# Altium project HGD_Sensor(v0.1)-20200807.PrjPcb
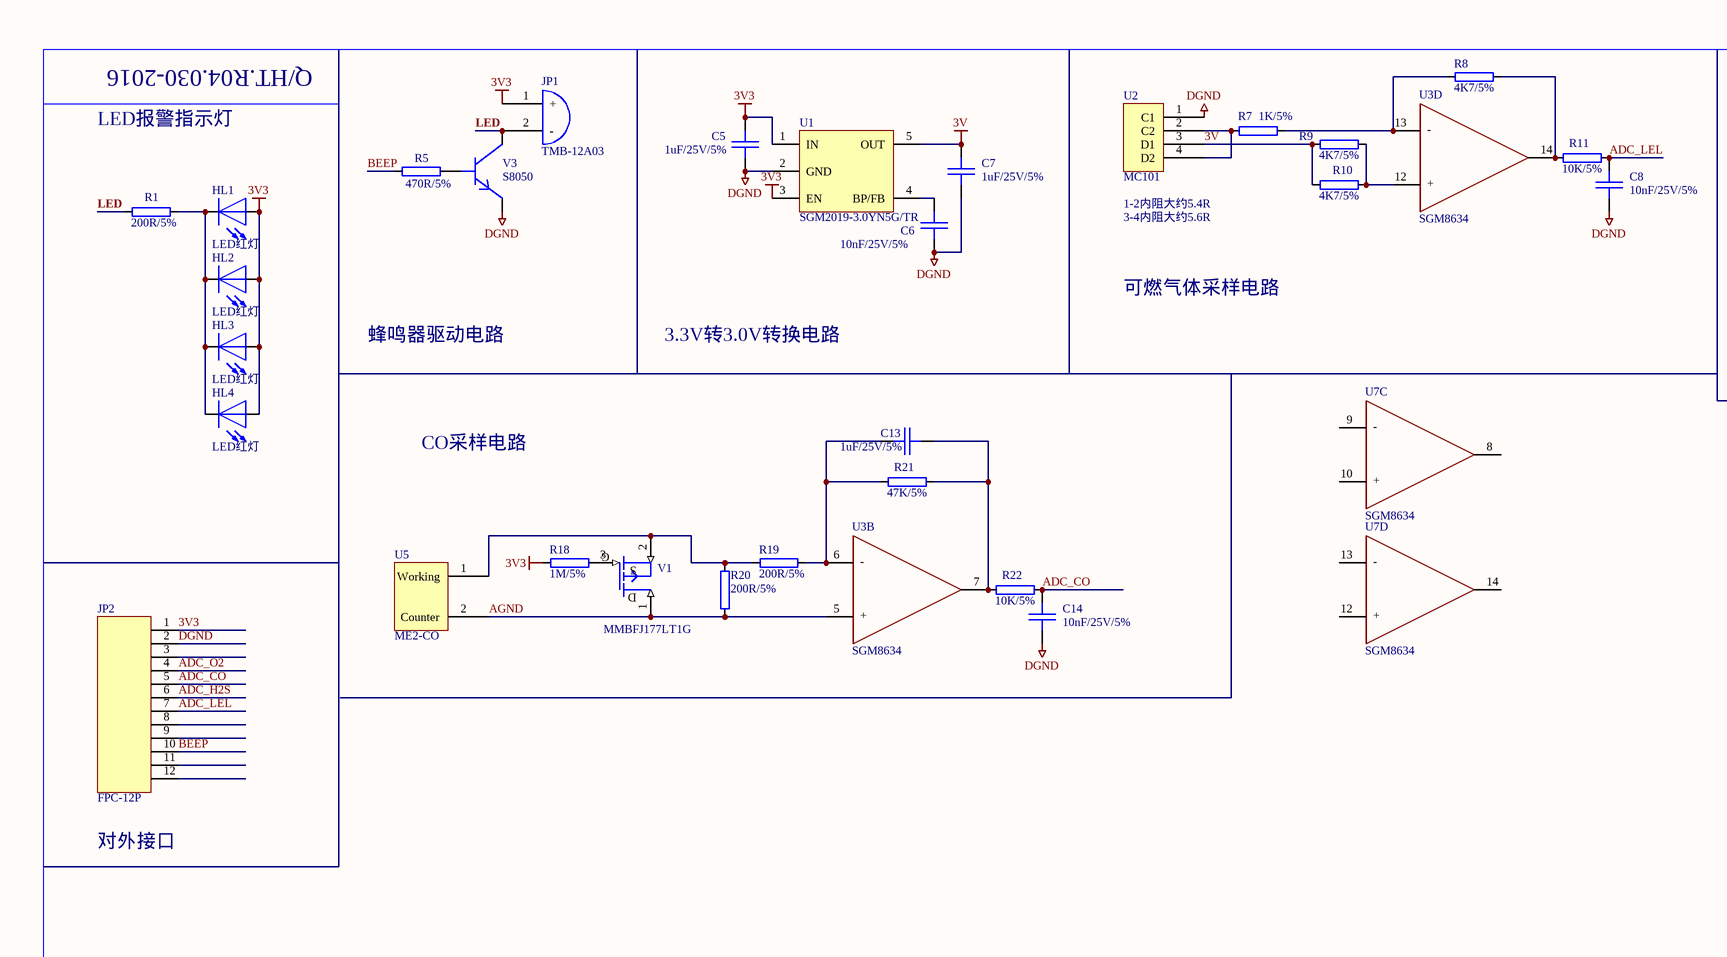
[diagram p0: HGD_Sensor(v0.1)-20200807.SchDoc, top left]
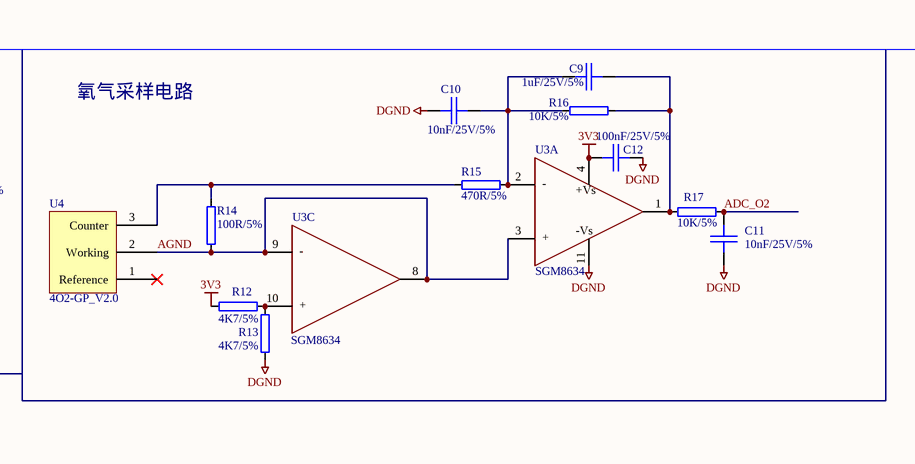
[diagram p1: HGD_Sensor(v0.1)-20200807.SchDoc, top right]
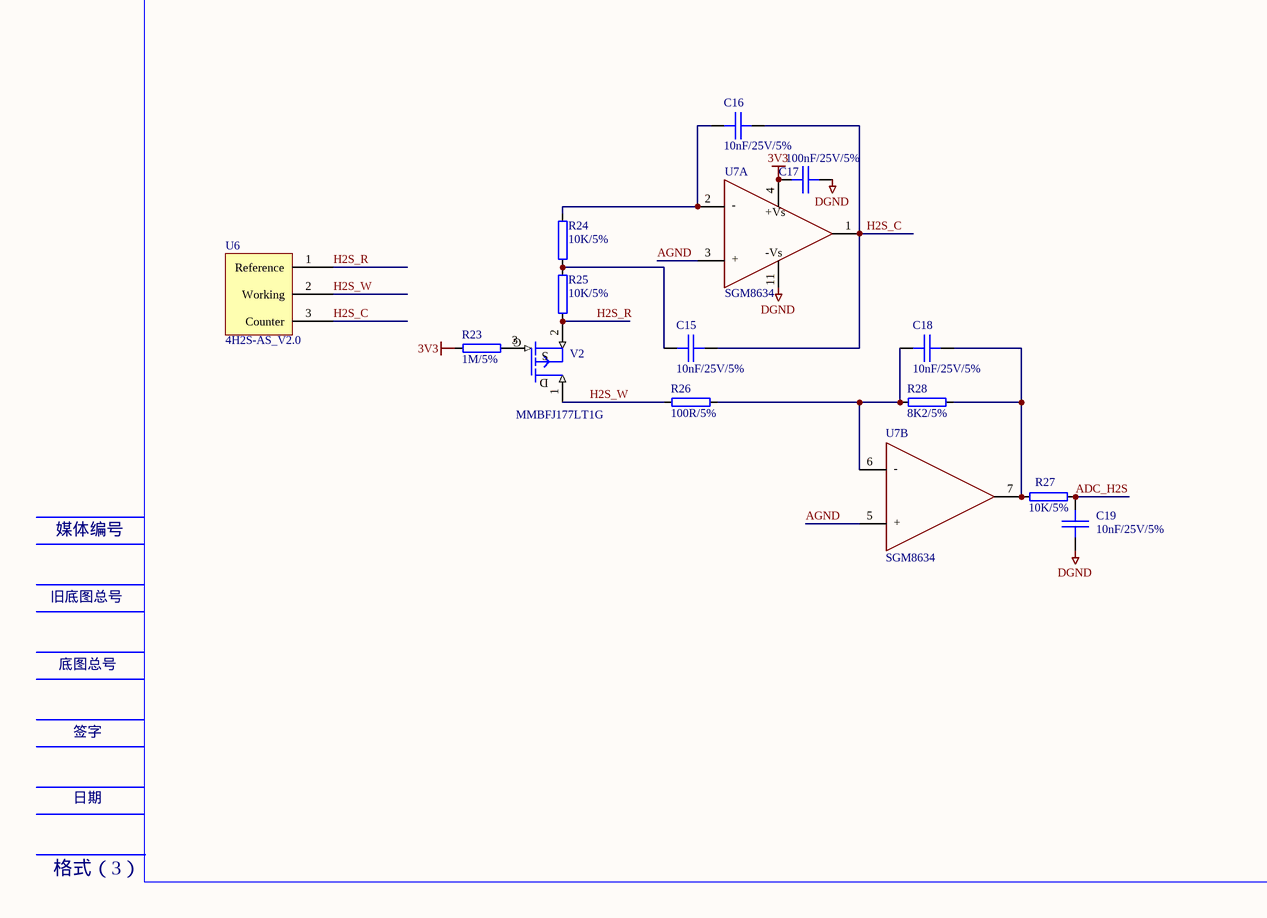
[diagram p2: HGD_Sensor(v0.1)-20200807.SchDoc, bottom left]
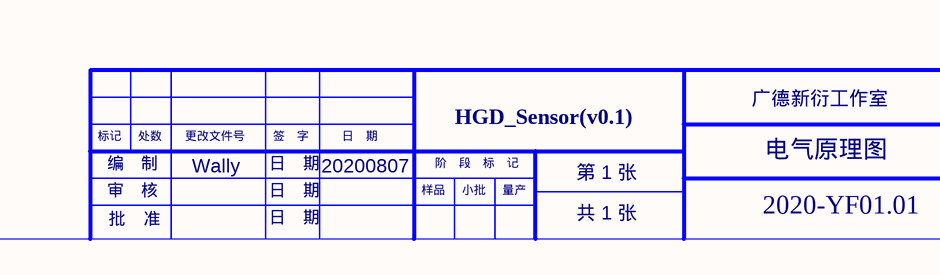
[diagram p3: HGD_Sensor(v0.1)-20200807.SchDoc, bottom right]
1 sheet, 55 parts. Net scope: global (net labels, ports and power ports of the same name join across sheets).
Board file: HGD_Sensor(v0.1)-20200807.PcbDoc

## Sheet HGD_Sensor(v0.1)-20200807.SchDoc
size A2; SheetNumber: 0; SheetTotal: 0; PageSetup: Record=PageOptions|CenterHorizontal=True|CenterVertical=True|PrintScale=0.71|XCorrection=1.00|YCorrection=1.00|PrintKind=2|BorderSize=5000000|LeftOffset=0|BottomOffset=0|Orientation=2|PaperLength=1000|PaperWidth=1000|Scale=100|PaperSource=7|PrintQuality=-4|MediaType=1|DitherType=10|PaperKind=A3|PrintScaleMode=1

### Parts
C5  1uF/25V/5%  [0805]
C6  10nF/25V/5%  [C0603]
C7  1uF/25V/5%  [0805]
C8  10nF/25V/5%  [C0603]
C9  1uF/25V/5%  [0805]
C10  10nF/25V/5%  [C0603]
C11  10nF/25V/5%  [C0603]
C12  100nF/25V/5%  [C0603]
C13  1uF/25V/5%  [0805]
C14  10nF/25V/5%  [C0603]
C15  10nF/25V/5%  [C0603]
C16  10nF/25V/5%  [C0603]
C17  100nF/25V/5%  [C0603]
C18  10nF/25V/5%  [C0603]
C19  10nF/25V/5%  [C0603]
HL1  LED红灯  [LED-3MM]
HL2  LED红灯  [LED-3MM]
HL3  LED红灯  [LED-3MM]
HL4  LED红灯  [LED-3MM]
JP1  TMB-12A03  [TMB-12A03]
JP2  FPC-12P  [FPC-1.0MM-12P-W]
R1  200R/5%  [R0603]
R5  470R/5%  [R0603]
R7  1K/5%  [R0603]
R8  4K7/5%  [R0603]
R9  4K7/5%  [R0603]
R10  4K7/5%  [R0603]
R11  10K/5%  [R0603]
R12  4K7/5%  [R0603]
R13  4K7/5%  [R0603]
R14  100R/5%  [R0603]
R15  470R/5%  [R0603]
R16  10K/5%  [R0603]
R17  10K/5%  [R0603]
R18  1M/5%  [R0603]
R19  200R/5%  [R0603]
R20  200R/5%  [R0603]
R21  47K/5%  [R0603]
R22  10K/5%  [R0603]
R23  1M/5%  [R0603]
R24  10K/5%  [R0603]
R25  10K/5%  [R0603]
R26  100R/5%  [R0603]
R27  10K/5%  [R0603]
R28  8K2/5%  [R0603]
U1  SGM2019-3.0YN5G/TR  [SGM2019_SOT23-5_95P280X125-5N]
U2  MC101  [MC101]
U3  SGM8634  [SGM8634_TSSOP14_65P640X120-14N]  (parts A,B,C,D of 5)
U4  4O2-GP_V2.0  [4O2-GP_V2.0-1.5K-3.2*2.5*5.8]
U5  ME2-CO  [ME2-CO_1.5K-3.2*2.5*5.8]
U6  4H2S-AS_V2.0  [4H2S-AS_V2.0-1.5K-3.0*2.5*5.8]
U7  SGM8634  [SGM8634_TSSOP14_65P640X120-14N]  (parts A,B,C,D of 5)
V1  MMBFJ177LT1G  [MMBFJ177LT1G_SOT-23]
V2  MMBFJ177LT1G  [MMBFJ177LT1G_SOT-23]
V3  S8050  [SOT-23]

### Nets
3V: C7.1 R9.2 R10.2 U1.5(OUT) U2.3(D1)
3V3: C5.1 C12.2 C17.2 HL1.A HL2.A HL3.A HL4.A JP1.1(+) JP2.1 R12.2 R18.2 R23.2 U1.1(IN) U1.3(EN) U3.4(+Vs) U7.4(+Vs)
DGND: C5.2 C6.2 C7.2 C8.2 C10.2 C11.2 C12.1 C14.2 C17.1 C19.2 JP2.2 R13.2 U1.2(GND) U2.1(C1) U3.11(-Vs) U7.11(-Vs) V3.E
ADC_CO: C14.1 JP2.5 R22.1
ADC_H2S: C19.1 JP2.6 R27.2
ADC_LEL: C8.1 JP2.7 R11.1
ADC_O2: C11.1 JP2.4 R17.1
AGND: R14.1 R20.2 U3.3(+) U3.5(+) U3.8 U3.9(-) U4.2(Working) U5.2(Counter) U7.3(+) U7.5(+) V1.1(D)
BEEP: JP2.10 R5.1
H2S_C: C15.1 C16.2 U6.3(Counter) U7.1
H2S_R: R25.2 U6.1(Reference) V2.2(S)
H2S_W: R26.1 U6.2(Working) V2.1(D)
LED: JP1.2(-) R1.2 V3.C
NetC6_1: C6.1 U1.4(BP/FB)
NetC9_1: C9.1 C10.1 R15.2 R16.2 U3.2(-)
NetC9_2: C9.2 R16.1 R17.2 U3.1
NetC13_1: C13.1 R19.1 R21.1 U3.6(-)
NetC13_2: C13.2 R21.2 R22.2 U3.7
NetC15_2: C15.2 R24.2 R25.1
NetC16_1: C16.1 R24.1 U7.2(-)
NetC18_1: C18.1 R27.1 R28.2 U7.7
NetC18_2: C18.2 R26.2 R28.1 U7.6(-)
NetHL1_K: HL1.K HL2.K HL3.K HL4.K R1.1
NetR5_2: R5.2 V3.B
NetR7_1: R7.1 R8.2 U3.13(-)
NetR7_2: R7.2 U2.2(C2) U2.4(D2)
NetR8_1: R8.1 R11.2 U3.14
NetR9_1: R9.1 R10.1 U3.12(+)
NetR12_1: R12.1 R13.1 U3.10(+)
NetR14_2: R14.2 R15.1 U4.3(Counter)
NetR18_1: R18.1 V1.3(G)
NetR19_2: R19.2 R20.1 U5.1(Working) V1.2(S)
NetR23_1: R23.1 V2.3(G)

Not connected (* = marked no-connect by the designer): JP2 3 8 9 11 12; U4 1(Reference)*; U7 8 9(-) 10(+) 12(+) 13(-) 14

### Notes on the sheet
- Q/HT.R04.030-2016
- LED报警指示灯
- 氧气采样电路
- (near U2) 1-2内阻大约5.4R
- 3-4内阻大约5.6R
- 可燃气体采样电路
- 蜂鸣器驱动电路
- 3.3V转3.0V转换电路
- CO采样电路
- 对外接口
- 媒体编号
- 旧底图总号
- 底图总号
- 签字
- HGD_Sensor(v0.1)
- 广德新衍工作室
- 日期
- 标记
- 编　制
- 审　核
- 处数
- 更改文件号
- Wally
- 日　期
- 签　字
- 20200807
- 样品
- 阶　段　标　记
- 小批
- 量产
- 第 1 张
- 电气原理图
- 格式（3）
- 批    准
- 共 1 张
- 2020-YF01.01

### Library data of the parts
C5-C19 = CAP: 电容
HL1-HL4 = 发光二极管
JP1 = TMB-12A03: TMB-12A03：3.3V有源蜂鸣器
R1 R5 R7-R28 = RES2: 电阻
U1 = SGM2019: SGM2019：Low Power, Low Dropout, RF Linear Regulators
U2 = MC101: MC101：可燃气体传感器
U3 U7 = SGM8634: SGM8634：470μA, 6MHz, Rail-to-Rail I/O, CMOS Operational Amplifier
U4 = 4O2-GP_V2.0: 4O2-GP_V2.0：O2传感器
U5 = ME2-CO: ME2-CO：CO传感器
U6 = 4H2S-AS_V2.0: 4H2S-AS_V2.0：H2S传感器
V1 V2 = MMBFJ177LT1G: MMBFJ177LT1G：P-JFET?Chopper
V3 = NPN: NPN三极管